# Altium project AMS_Master.PrjPCB
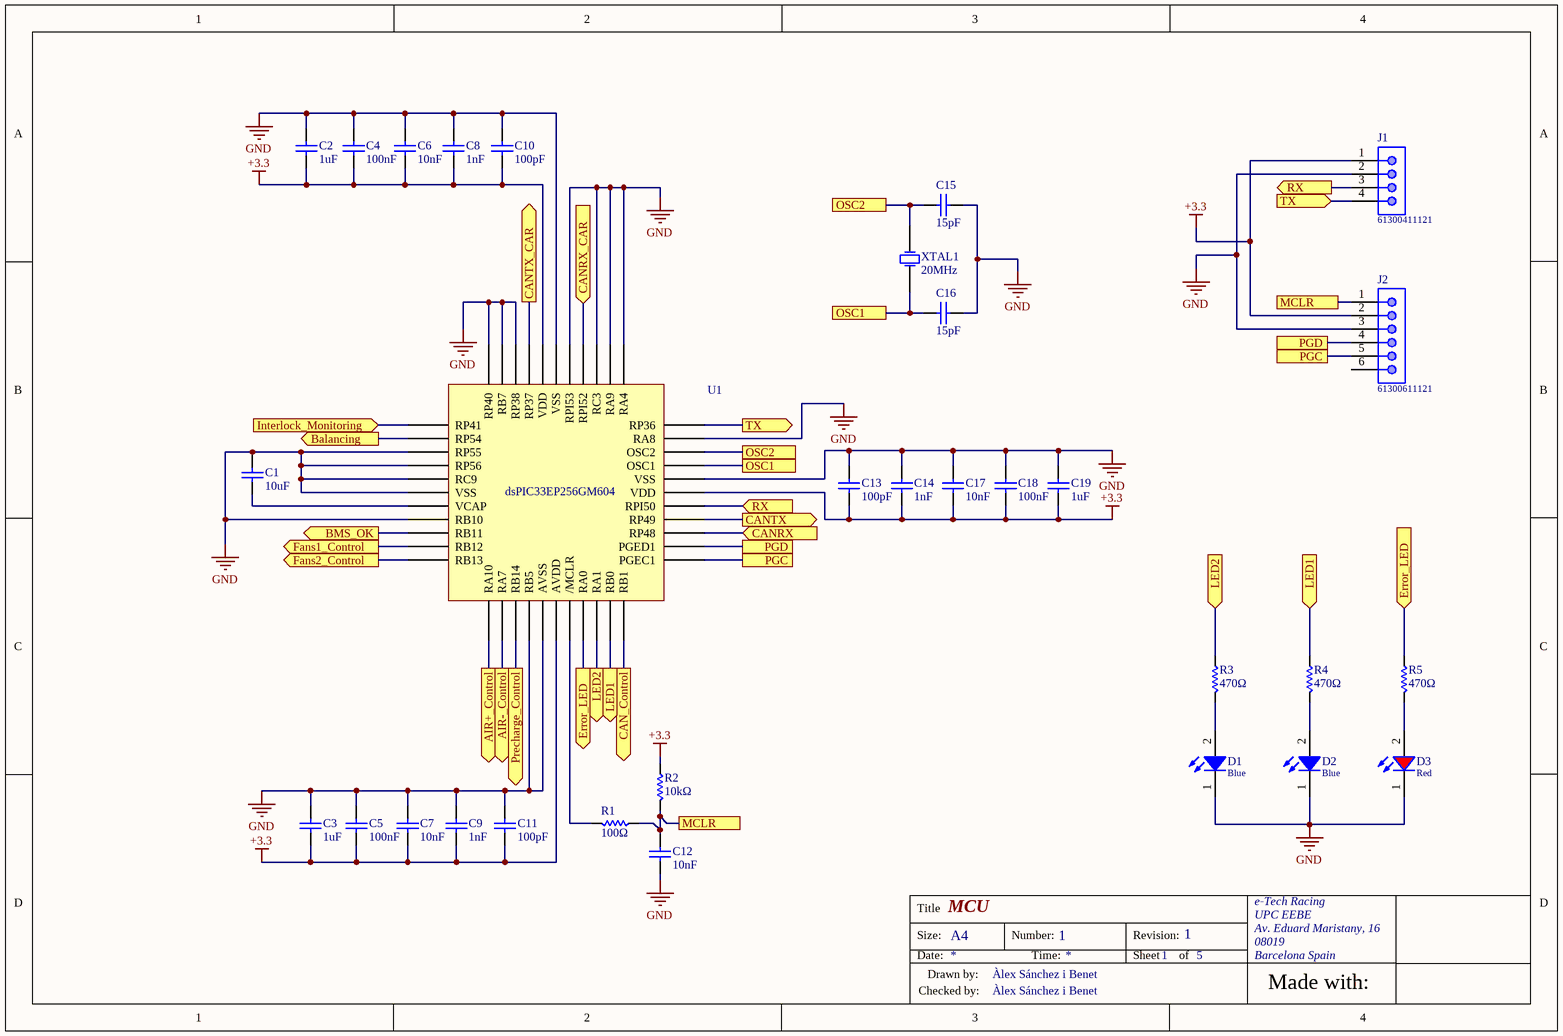
[diagram p0: AMS_MCU.SchDoc]
1 sheet, 31 parts. Net scope: flat (ports and power ports of the same name join across sheets).
Board file: AMS_Master.PcbDoc

## Sheet AMS_MCU.SchDoc: MCU
size A4; CheckedBy: Àlex Sánchez i Benet; DrawnBy: Àlex Sánchez i Benet; DocumentNumber: 1; Revision: 1; SheetNumber: 1; SheetTotal: 5; University: UPC EEBE; City: Barcelona; Country: Spain; CP: 08019; Address: Av. Eduard Maristany, 16

### Parts
C1  10uF  [0805_2x1.25x1.25mm_Reflow Soldering]
C2  1uF  [0805_2x1.25x1.25mm_Reflow Soldering]
C3  1uF  [0805_2x1.25x1.25mm_Reflow Soldering]
C4  100nF  [0805_2x1.25x0.8mm_Reflow Soldering]
C5  100nF  [0805_2x1.25x0.8mm_Reflow Soldering]
C6  10nF  [0805_2x1.25x0.8mm_Reflow Soldering]
C7  10nF  [0805_2x1.25x0.8mm_Reflow Soldering]
C8  1nF  [0805_2x1.25x0.8mm_Reflow Soldering]
C9  1nF  [0805_2x1.25x0.8mm_Reflow Soldering]
C10  100pF  [0805_2x1.25x0.6mm_Reflow Soldering]
C11  100pF  [0805_2x1.25x0.6mm_Reflow Soldering]
C12  10nF  [0805_2x1.25x0.8mm_Reflow Soldering]
C13  100pF  [0805_2x1.25x0.6mm_Reflow Soldering]
C14  1nF  [0805_2x1.25x0.8mm_Reflow Soldering]
C15  15pF  [0805_2x1.25x0.6mm_Reflow Soldering]
C16  15pF  [0805_2x1.25x0.6mm_Reflow Soldering]
C17  10nF  [0805_2x1.25x0.8mm_Reflow Soldering]
C18  100nF  [0805_2x1.25x0.8mm_Reflow Soldering]
C19  1uF  [0805_2x1.25x1.25mm_Reflow Soldering]
D1  Blue  [WL-SMCW_0805]
D2  Blue  [WL-SMCW_0805]
D3  Red  [WL-SMCW_0805]
J1  61300411121  [61300411121]
J2  61300611121  [61300611121]
R1  100Ω  [CR0805]
R2  10kΩ  [CR0805]
R3  470Ω  [CR0805]
R4  470Ω  [CR0805]
R5  470Ω  [CR0805]
U1  dsPIC33EP256GM604  [dsPIC33EP256GM604]
XTAL1  20MHz  [830028710]

### Ports
AIR+_Control (out), AIR-_Control (out), Balancing (out), BMS_OK (out), CAN_Control (out), CANRX (in), CANRX_CAR (in), CANTX (out), CANTX_CAR (out), Error_LED (in), Error_LED (out), Fans1_Control (out), Fans2_Control (out), Interlock_Monitoring (in), LED1 (in), LED1 (out), LED2 (in), LED2 (out), MCLR, OSC1, OSC2, PGC, PGD, Precharge_Control (out), RX (in), RX (out), TX (in), TX (out)

### Nets
+3.3: C2.1 C3.1 C4.1 C5.1 C6.1 C7.1 C8.1 C9.1 C10.1 C11.1 C13.1 C14.1 C17.1 C18.1 C19.1 J1.1 J2.2 R2.2 U1.17(AVDD) U1.28(VDD) U1.40(VDD)
GND: C1.2 C2.2 C3.2 C4.2 C5.2 C6.2 C7.2 C8.2 C9.2 C10.2 C11.2 C12.1 C13.2 C14.2 C15.2 C16.2 C17.2 C18.2 C19.2 D1.1(K) D2.1(K) D3.1(K) J1.2 J2.3 U1.3(RP55) U1.4(RP56) U1.5(RC9) U1.6(VSS) U1.8(RB10) U1.15(RB5) U1.16(AVSS) U1.29(VSS) U1.32(RA8) U1.34(RA4) U1.35(RA9) U1.36(RC3) U1.38(RPI53) U1.39(VSS) U1.42(RP38) U1.43(RB7) U1.44(RP40)
NetC1_1: C1.1 U1.7(VCAP)
NetC12_2: C12.2 J2.1 R1.2 R2.1 ; port MCLR
NetC15_1: C15.1 U1.31(OSC2) XTAL1.2(OSC2) ; port OSC2
NetC16_1: C16.1 U1.30(OSC1) XTAL1.1(OSC1) ; port OSC1
NetD1_2: D1.2(A) R3.1
NetD2_2: D2.2(A) R4.1
NetD3_2: D3.2(A) R5.1
NetJ1_3: J1.3 U1.27(RPI50) ; port RX
NetJ1_4: J1.4 U1.33(RP36) ; port TX
NetJ2_4: J2.4 U1.24(PGED1) ; port PGD
NetJ2_5: J2.5 U1.23(PGEC1) ; port PGC
NetR1_1: R1.1 U1.18(/MCLR)
NetR3_2: R3.2 U1.20(RA1) ; port LED2
NetR4_2: R4.2 U1.21(RB0) ; port LED1
NetR5_2: R5.2 U1.19(RA0) ; port Error_LED
NetU1_1: U1.1(RP41) ; port Interlock_Monitoring
NetU1_2: U1.2(RP54) ; port Balancing
NetU1_9: U1.9(RB11) ; port BMS_OK
NetU1_10: U1.10(RB12) ; port Fans1_Control
NetU1_11: U1.11(RB13) ; port Fans2_Control
NetU1_12: U1.12(RA10) ; port AIR+_Control
NetU1_13: U1.13(RA7) ; port AIR-_Control
NetU1_14: U1.14(RB14) ; port Precharge_Control
NetU1_22: U1.22(RB1) ; port CAN_Control
NetU1_25: U1.25(RP48) ; port CANRX
NetU1_26: U1.26(RP49) ; port CANTX
NetU1_37: U1.37(RPI52) ; port CANRX_CAR
NetU1_41: U1.41(RP37) ; port CANTX_CAR

Not connected (* = marked no-connect by the designer): J2 6

### Notes on the sheet
- Title
- e-Tech Racing
- UPC EEBE
- Size:
- Date:
- Drawn by:
- A4
- Number:
- Time:
- Revision:
- Sheet
- of
- Av. Eduard Maristany, 16
- 08019
- Barcelona Spain
- Made with:
- Checked by:

### Library data of the parts
C1 = 885012107014: WCAP-CSGP Ceramic Capacitors, 0805, X5R, 16V, 10uF; Rated Voltage: 16V DC; ComponentLink1Description: Manufacturer; ComponentLink1URL: http://www.we-online.de; ComponentLink2Description: Datasheet; ComponentLink2URL: http://katalog.we-online.de/pbs/datasheet/885012107014.pdf; Part Number: 885012107014; Published Date: Oct. 2017; Publisher: Wurth Elektronik; Size: 0805; Operating Temperature: -55 °C to +125 °C; Value: 10uF; Ceramic Type: X5R
C2 C3 C19 = 885012207103: WCAP-CSGP Ceramic Capacitors, 0805, X7R, 50V, 1uF; Rated Voltage: 50V DC; ComponentLink1Description: Manufacturer; ComponentLink1URL: http://www.we-online.de; ComponentLink2Description: Datasheet; ComponentLink2URL: http://katalog.we-online.de/pbs/datasheet/885012207103.pdf; Part Number: 885012207103; Publisher: Wurth Elektronik; Size: 0805; Operating Temperature: -55 °C to +125 °C; Value: 1uF; Ceramic Type: X7R
C4 C5 C18 = 885012207098: WCAP-CSGP Ceramic Capacitors, 0805, X7R, 50V, 100nF; Rated Voltage: 50V DC; ComponentLink1Description: Manufacturer; ComponentLink1URL: http://www.we-online.de; ComponentLink2Description: Datasheet; ComponentLink2URL: http://katalog.we-online.de/pbs/datasheet/885012207098.pdf; Part Number: 885012207098; Publisher: Wurth Elektronik; Size: 0805; Operating Temperature: -55 °C to +125 °C; Value: 100nF; Ceramic Type: X7R
C6 C7 C12 C17 = 885012207092: WCAP-CSGP Ceramic Capacitors, 0805, X7R, 50V, 10nF; Rated Voltage: 50V DC; ComponentLink1Description: Manufacturer; ComponentLink1URL: http://www.we-online.de; ComponentLink2Description: Datasheet; ComponentLink2URL: http://katalog.we-online.de/pbs/datasheet/885012207092.pdf; Part Number: 885012207092; Publisher: Wurth Elektronik; Size: 0805; Operating Temperature: -55 °C to +125 °C; Value: 10nF; Ceramic Type: X7R
C8 C9 C14 = 885012007063: WCAP-CSGP Ceramic Capacitors, 0805, NP0, 50V, 1nF; Rated Voltage: 50V DC; ComponentLink1Description: Manufacturer; ComponentLink1URL: http://www.we-online.de; ComponentLink2Description: Datasheet; ComponentLink2URL: http://katalog.we-online.de/pbs/datasheet/885012007063.pdf; Part Number: 885012007063; Published Date: Oct. 2017; Publisher: Wurth Elektronik; Size: 0805; Operating Temperature: -55 °C to +125 °C; Value: 1nF; Ceramic Type: NP0
C10 C11 C13 = 885012007057: WCAP-CSGP Ceramic Capacitors, 0805, NP0, 50V, 100pF; Rated Voltage: 50V DC; ComponentLink1Description: Manufacturer; ComponentLink1URL: http://www.we-online.de; ComponentLink2Description: Datasheet; ComponentLink2URL: http://katalog.we-online.de/pbs/datasheet/885012007057.pdf; Part Number: 885012007057; Published Date: Oct. 2017; Publisher: Wurth Elektronik; Size: 0805; Operating Temperature: -55 °C to +125 °C; Value: 100pF; Ceramic Type: NP0
C15 C16 = 885012007052: WCAP-CSGP Ceramic Capacitors, 0805, NP0, 50V, 15pF; Rated Voltage: 50V DC; ComponentLink1Description: Manufacturer; ComponentLink1URL: http://www.we-online.de; ComponentLink2Description: Datasheet; ComponentLink2URL: http://katalog.we-online.de/pbs/datasheet/885012007052.pdf; Part Number: 885012007052; Published Date: Oct. 2017; Publisher: Wurth Elektronik; Size: 0805; Operating Temperature: -55 °C to +125 °C; Value: 15pF; Ceramic Type: NP0
D1 D2 = 150080BS75000: SMT Mono-color Chip LED Waterclear WL-SMCW, size 0805, Blue, 3.2 V, 140 deg, 145 mcd; Forward Voltage: 3.2 V; Viewing Angle: 140 deg; Peak Wavelength: 465 nm; Dominant Wavelength: 470 nm; Luminous Intensity: 145 mcd; Chip Technology: InGaN; ComponentLink1Description: Manufacturer; ComponentLink1URL: http://www.we-online.de; ComponentLink2Description: Datasheet; ComponentLink2URL: https://katalog.we-online.de/led/datasheet/150080BS75000.pdf; Part Number: 150080BS75000; Published Date: November 2018; Publisher: Wurth Elektronik; Size: 0805; Operating Temperature: -40 to 85 degC; Emitting Color: Blue; Mounting Technology: SMT; Packaging: Tape and Reel
D3 = 150080RS75000: SMT Mono-color Chip LED Waterclear WL-SMCW, size 0805, Red, 2 V, 140 deg, 150 mcd; Forward Voltage: 2 V; Viewing Angle: 140 deg; Peak Wavelength: 630 nm; Dominant Wavelength: 625 nm; Luminous Intensity: 150 mcd; Chip Technology: AlInGaP; ComponentLink1Description: Manufacturer; ComponentLink1URL: http://www.we-online.de; ComponentLink2Description: Datasheet; ComponentLink2URL: https://katalog.we-online.de/led/datasheet/150080RS75000.pdf; Part Number: 150080RS75000; Published Date: November 2018; Publisher: Wurth Elektronik; Size: 0805; Operating Temperature: -40 to 85 degC; Emitting Color: Red; Mounting Technology: SMT; Packaging: Tape and Reel
J1 = 61300411121: THT Vertical Pin Header WR-PHD, Pitch 2.54 mm, Single Row, 4 pins; Pin Number: 4; Pitch: 2.54 mm; Gender: Male; Rated Current: 3 A; Working Voltage: 250 VAC; Withstanding Voltage: 500 VAC; Contact Resistance: 20 mOhm; ComponentLink1Description: Manufacturer; ComponentLink1URL: http://www.we-online.de; ComponentLink2Description: Datasheet; ComponentLink2URL: https://katalog.we-online.de/em/datasheet/6130xx11121.pdf; Part Number: 61300411121; Published Date: August 2018; Publisher: Wurth Elektronik; Operating Temperature: -40 to 105 degC; Mounting Technology: THT; Packaging: Bag; Row Number: Single; Orientation: Vertical
J2 = 61300611121: THT Vertical Pin Header WR-PHD, Pitch 2.54 mm, Single Row, 6 pins; Pin Number: 6; Pitch: 2.54 mm; Gender: Male; Rated Current: 3 A; Working Voltage: 250 VAC; Withstanding Voltage: 500 VAC; Contact Resistance: 20 mOhm; ComponentLink1Description: Manufacturer; ComponentLink1URL: http://www.we-online.de; ComponentLink2Description: Datasheet; ComponentLink2URL: https://katalog.we-online.de/em/datasheet/6130xx11121.pdf; Part Number: 61300611121; Published Date: August 2018; Publisher: Wurth Elektronik; Operating Temperature: -40 to 105 degC; Mounting Technology: THT; Packaging: Bag; Row Number: Single; Orientation: Vertical
R1 = CR0805-FX-1000ELF: Chip Resistor 0805; Manufacturer: Bourns; ComponentLink1Description: Datasheet; ComponentLink1URL: https://www.bourns.com/docs/product-datasheets/chpreztr.pdf?sfvrsn=566c91f1_11
R2 = CR0805-JW-103ELF: Chip Resistor 0805; Manufacturer: Bourns; ComponentLink1Description: Datasheet; ComponentLink1URL: https://www.bourns.com/docs/product-datasheets/chpreztr.pdf?sfvrsn=566c91f1_11
R3-R5 = CR0805-FX-4700GLF: Chip Resistor 0805; Manufacturer: Bourns; ComponentLink1Description: Datasheet; ComponentLink1URL: https://www.bourns.com/docs/product-datasheets/chpreztr.pdf?sfvrsn=566c91f1_11
U1 = dsPIC33EP256GM604: 16-Bit Digital Signal Controller with High-Speed PWM, Op Amps and Advanced Analog Features; Manufacturer: Microchip; Pins: 44; ComponentLink1Description: Datasheet; ComponentLink1URL: http://ww1.microchip.com/downloads/en/DeviceDoc/70000689d.pdf
XTAL1 = 830028710: Industry standard SMD crystal WE-XTAL Quartz Crystal; Manufacturer: Wurth Elektronik; Model: HC49/4HSMX; ComponentLink1Description: Datasheet; ComponentLink1URL: https://katalog.we-online.com/pbs/datasheet/830028710.pdf; Mounting Technology: SMT; Frequency: 20MHz